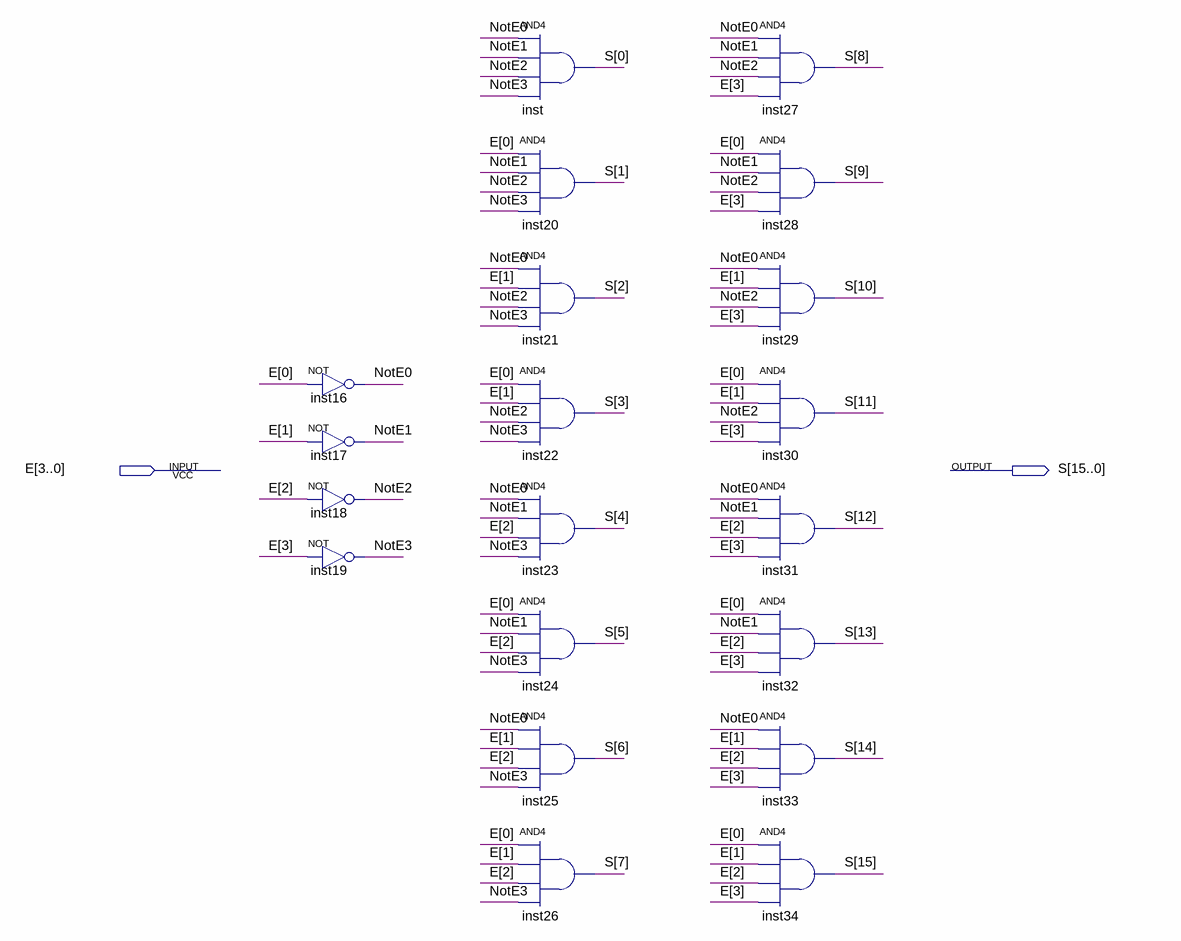
[diagram p0: schematic sheet]
// Quartus schematic decod.bdf as structural Verilog: 20 symbols, 2 pins
module decod (
  input  [3:0] E,
  output [15:0] S
);

  wire NotE0, NotE1, NotE2, NotE3;

  not inst16 (NotE0, E[0]);
  not inst17 (NotE1, E[1]);
  not inst18 (NotE2, E[2]);
  not inst19 (NotE3, E[3]);
  and inst (S[0], NotE0, NotE1, NotE2, NotE3);
  and inst20 (S[1], E[0], NotE1, NotE2, NotE3);
  and inst21 (S[2], NotE0, E[1], NotE2, NotE3);
  and inst22 (S[3], E[0], E[1], NotE2, NotE3);
  and inst23 (S[4], NotE0, NotE1, E[2], NotE3);
  and inst24 (S[5], E[0], NotE1, E[2], NotE3);
  and inst25 (S[6], NotE0, E[1], E[2], NotE3);
  and inst26 (S[7], E[0], E[1], E[2], NotE3);
  and inst27 (S[8], NotE0, NotE1, NotE2, E[3]);
  and inst28 (S[9], E[0], NotE1, NotE2, E[3]);
  and inst29 (S[10], NotE0, E[1], NotE2, E[3]);
  and inst30 (S[11], E[0], E[1], NotE2, E[3]);
  and inst31 (S[12], NotE0, NotE1, E[2], E[3]);
  and inst32 (S[13], E[0], NotE1, E[2], E[3]);
  and inst33 (S[14], NotE0, E[1], E[2], E[3]);
  and inst34 (S[15], E[0], E[1], E[2], E[3]);
endmodule
